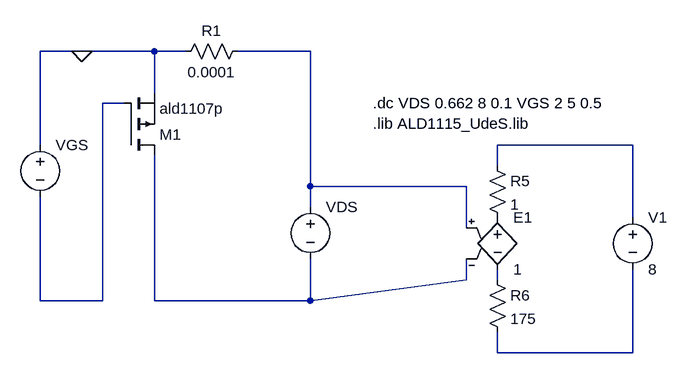
[diagram p0: schematic droite de chagre_pmos_adl1107p.asc]
droite de chagre_pmos_adl1107p.asc, the LTspice schematic file:
Version 4
SHEET 1 2068 680
WIRE 560 -80 496 -80
WIRE 672 -80 560 -80
WIRE 720 -80 672 -80
WIRE 912 -80 800 -80
WIRE 672 -16 672 -80
WIRE 624 0 592 0
WIRE 496 64 496 -80
WIRE 1408 64 1200 64
WIRE 1200 96 1200 64
WIRE 912 128 912 -80
WIRE 1152 128 912 128
WIRE 912 160 912 128
WIRE 1408 176 1408 64
WIRE 1152 192 1152 128
WIRE 1152 272 1152 240
WIRE 1200 272 1200 256
WIRE 496 304 496 144
WIRE 592 304 592 0
WIRE 592 304 496 304
WIRE 672 304 672 80
WIRE 912 304 912 240
WIRE 912 304 1152 272
WIRE 912 304 672 304
WIRE 1200 384 1200 352
WIRE 1408 384 1408 256
WIRE 1408 384 1200 384
FLAG 560 -80 0
SYMBOL voltage 496 48 R0
WINDOW 123 0 0 Left 0
WINDOW 39 0 0 Left 0
SYMATTR InstName VGS
SYMATTR Value ""
SYMBOL res 816 -96 R90
WINDOW 0 0 56 VBottom 2
WINDOW 3 32 56 VTop 2
SYMATTR InstName R1
SYMATTR Value 0.0001
SYMBOL voltage 912 144 R0
WINDOW 123 0 0 Left 0
WINDOW 39 0 0 Left 0
SYMATTR InstName VDS
SYMATTR Value ""
SYMBOL voltage 1408 160 R0
WINDOW 123 0 0 Left 0
WINDOW 39 0 0 Left 0
SYMATTR InstName V1
SYMATTR Value 8
SYMBOL e 1200 160 R0
SYMATTR InstName E1
SYMATTR Value 1
SYMBOL /pmos 624 80 M180
SYMATTR InstName M1
SYMATTR Value ald1107p
SYMATTR Prefix X
SYMBOL res 1184 80 R0
SYMATTR InstName R5
SYMATTR Value 1
SYMBOL res 1184 256 R0
SYMATTR InstName R6
SYMATTR Value 175
TEXT 1008 0 Left 2 !.dc VDS 0.662 8 0.1 VGS 2 5 0.5\n.lib ALD1115_UdeS.lib

The netlist it stands for:
* droite de chagre_pmos_adl1107p.asc
VGS 0 N002
R1 N001 0 0.0001
VDS N001 N004
V1 N003 N006 8
E1 P001 N005 N001 N004 1
XM1 N004 N002 0 ald1107p  ; pins D G S
R5 N003 P001 1
R6 N005 N006 175
.dc VDS 0.662 8 0.1 VGS 2 5 0.5
.lib ALD1115_UdeS.lib
.backanno
.end